# EAGLE board snarc+ (EAGLE 6.2)
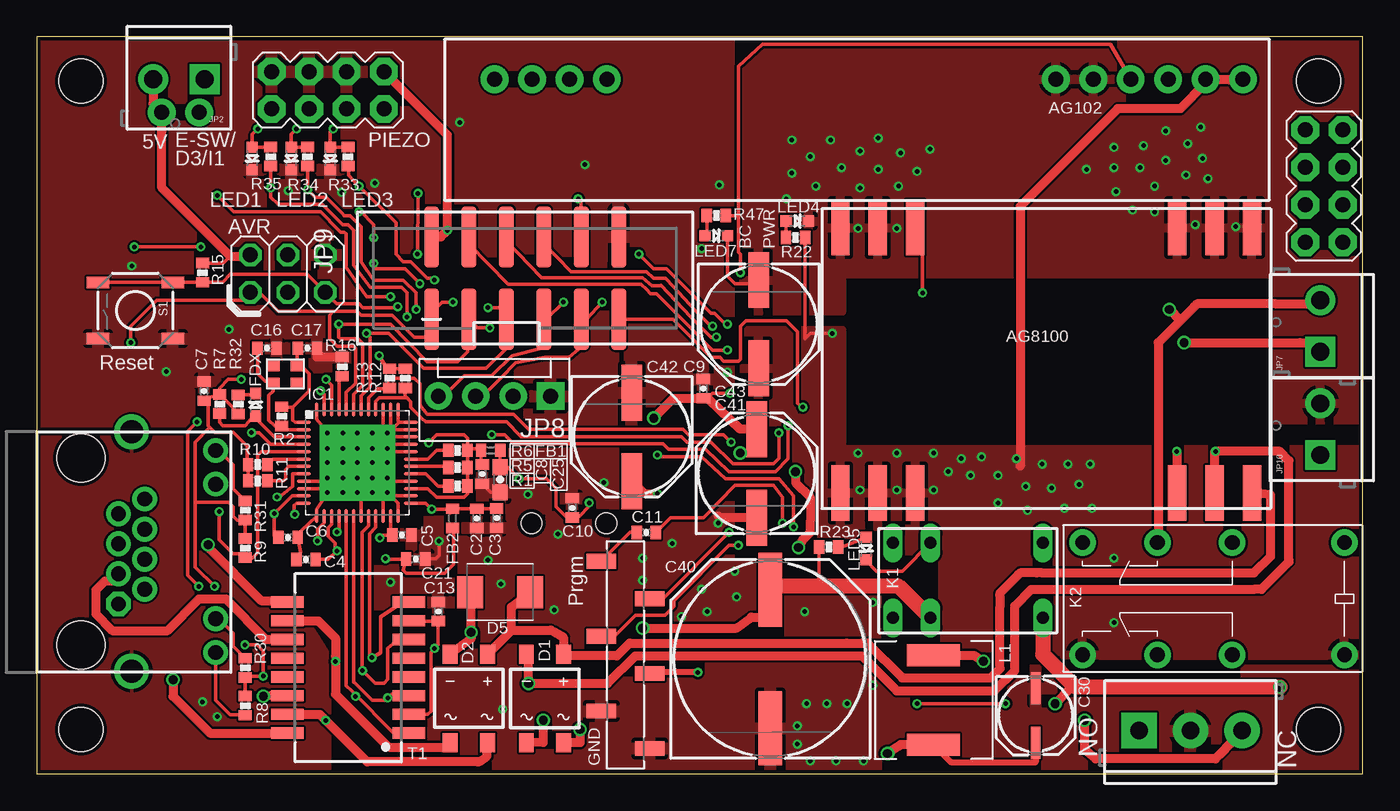
[diagram p1: board, top side]
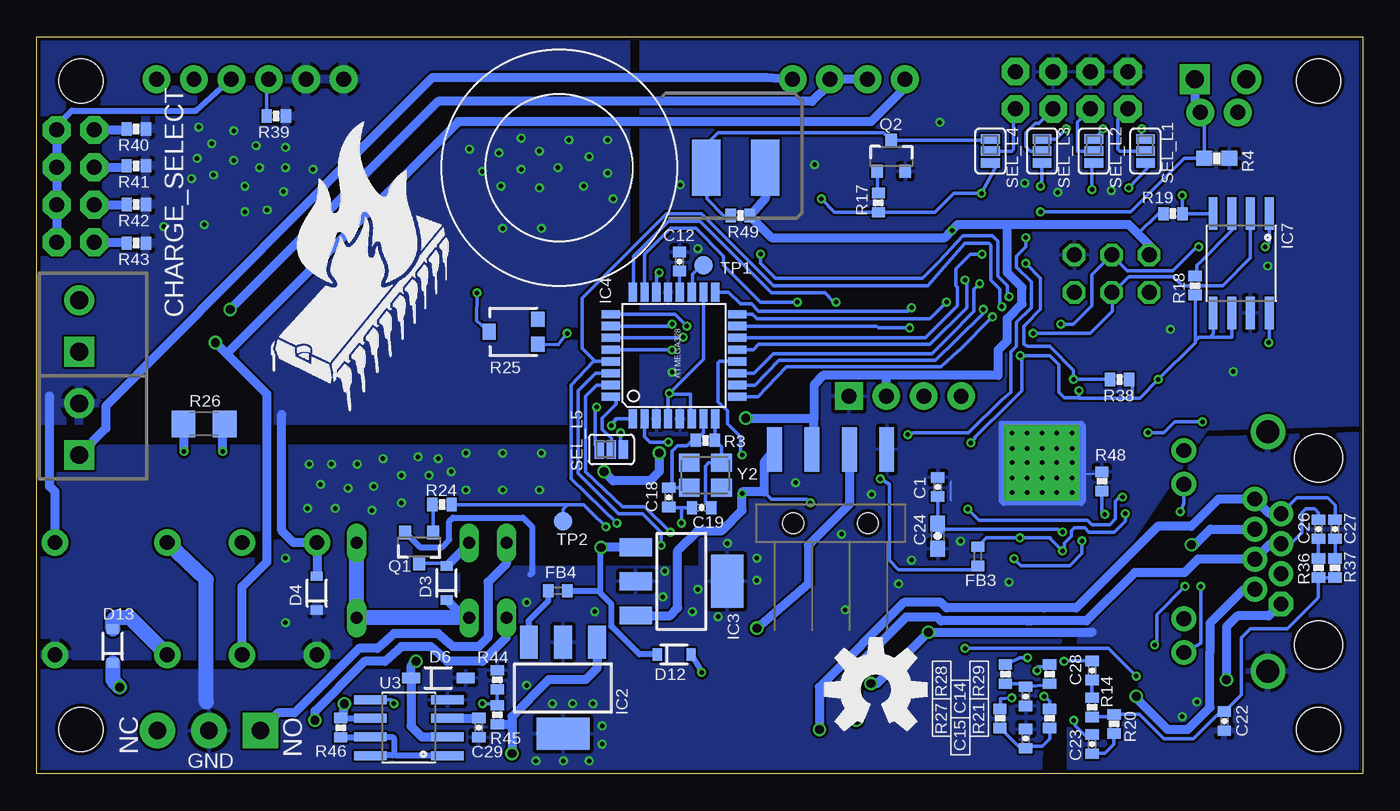
[diagram p2: board, bottom side, seen from below]

Size 90 x 50 mm. Coordinates in mm from the lower left corner, seen from the top.
Outline: 0,0 90,0 90,50 0,50 0,0
Copper layers (1*2*15*16): Top 0.035mm / dielectric 1.5mm / Route2 0.035mm / dielectric 0.15mm / Route15 0.035mm / dielectric 0.2mm / Bottom 0.035mm
Design rules: minimum track width 6mil, minimum drill 12mil, track to track 6mil, track to pad 6mil, pad to pad 6mil, via to via 6mil, smd to smd 0mil, copper to edge 10mil, drill to drill 10mil, minimum pad ring 10mil, minimum via ring 6mil, stop-mask expansion 2mil, vias tented up to drill 100mil, thermal gap 10mil
Net classes: 2 gnd: width 0.305 mm, drill 0.406 mm, clearance 0.203 mm; 3 power usb: width 0.508 mm, drill 0.406 mm, clearance 0.203 mm
Holes 3 mm at 3,47 3,3 87,47 87,3

## Footprints (pad centres in the part's own frame; a part is rotated, then mirrored left to right if it is on the bottom)
AG102 = drill 1.016 pad 1.88: 1 0,0; 2 2.54,0; 3 5.08,0; 4 7.62,0; 5 10.16,0; 6 12.7,0; 7 43.18,0; 8 45.72,0; 9 48.26,0; 10 50.8,0
AG8100 = smd 1.25 x 3.75: 1 -5.08,-18; 2 -2.54,-18; 3 0,-18; 4 17.78,-18; 5 20.32,-18; 6 22.86,-18; 7 22.86,0; 8 20.32,0; 9 17.78,0; 10 0,0; 11 -2.54,0; 12 -5.08,0
0402-CAP = smd 0.7 x 0.9: 1 -0.65,0; 2 0.65,0
0603-CAP = smd 1.1 x 1: 1 -0.85,0; 2 0.85,0
PANASONIC_C = smd 2.2 x 0.65: + 1.9,-0.2; - -1.8,-0.2
PANASONIC_H13 = smd 5 x 1.6: + 4.7,0; - -4.7,0
PANASONIC_E = smd 3.8 x 1.4: + 3,0; - -3,0
2X4 = drill 1.016 pad 1.88 octagon: 1 -3.81,-1.27; 2 -3.81,1.27; 3 -1.27,-1.27; 4 -1.27,1.27; 5 1.27,-1.27; 6 1.27,1.27; 7 3.81,-1.27; 8 3.81,1.27
MBS = smd 1 x 1.3: + -1.27,-3; - 1.27,-3; AC1 -1.27,3; AC2 1.27,3
SOD-323 = smd 0.63 x 0.83: 1 -1.15,0; 2 1.15,0
SMBJ = smd 1.78 x 2.16: A 2.04,0; C -2.03,0
SOD-123 = smd 1.2 x 0.7: 1 -1.85,0; 2 1.85,0
0402 = smd 0.7 x 0.9: 1 -0.65,0; 2 0.65,0
QFN48 = smd 0.95 x 0.23: 1 -3.625,2.75; 2 -3.625,2.25; 3 -3.625,1.75; 4 -3.625,1.25; 5 -3.625,0.75; 6 -3.625,0.25; 7 -3.625,-0.25; 8 -3.625,-0.75; 9 -3.625,-1.25; 10 -3.625,-1.75; 11 -3.625,-2.25; 12 -3.625,-2.75; 25 3.625,-2.75; 26 3.625,-2.25; 27 3.625,-1.75; 28 3.625,-1.25; 29 3.625,-0.75; 30 3.625,-0.25; 31 3.625,0.25; 32 3.625,0.75; 33 3.625,1.25; 34 3.625,1.75; 35 3.625,2.25; 36 3.625,2.75 | smd 0.23 x 0.95: 13 -2.75,-3.625; 14 -2.25,-3.625; 15 -1.75,-3.625; 16 -1.25,-3.625; 17 -0.75,-3.625; 18 -0.25,-3.625; 19 0.25,-3.625; 20 0.75,-3.625; 21 1.25,-3.625; 22 1.75,-3.625; 23 2.25,-3.625; 24 2.75,-3.625; 37 2.75,3.625; 38 2.25,3.625; 39 1.75,3.625; 40 1.25,3.625; 41 0.75,3.625; 42 0.25,3.625; 43 -0.25,3.625; 44 -0.75,3.625; 45 -1.25,3.625; 46 -1.75,3.625; 47 -2.25,3.625; 48 -2.75,3.625 | drill 0.305 pad 1.1 square: EXP@1 -2.025,2.025; EXP@2 -1,2.025; EXP@3 0,2.025; EXP@4 1.025,2.025; EXP@5 -2.025,0.975; EXP@6 -1,0.975; EXP@7 0,0.975; EXP@8 1.025,0.975; EXP@9 -2.025,0.025; EXP@10 -1,0.025; EXP@11 0,0.025; EXP@12 1.025,0.025; EXP@13 -2.025,-1.025; EXP@14 -1,-1.025; EXP@15 0,-1.025; EXP@16 1.025,-1.025; EXP@17 -2.025,-2.025; EXP@18 -1,-2.025; EXP@19 0,-2.025; EXP@20 1.025,-2.025; EXP@21 2.025,-2.025; EXP@22 2.025,-1.025; EXP@23 2.025,0.025; EXP@24 2.025,0.975; EXP@25 2.025,2.025
SOT223 = smd 1.219 x 2.235: 1 -2.311,-3.099; 2 0,-3.099; 3 2.311,-3.099 | smd 3.6 x 2.2: 4 0,3.099
TQFP32-08 = smd 1.27 x 0.559: 1 -4.293,2.8; 2 -4.293,2; 3 -4.293,1.2; 4 -4.293,0.4; 5 -4.293,-0.4; 6 -4.293,-1.2; 7 -4.293,-2; 8 -4.293,-2.8; 17 4.293,-2.8; 18 4.293,-2; 19 4.293,-1.2; 20 4.293,-0.4; 21 4.293,0.4; 22 4.293,1.2; 23 4.293,2; 24 4.293,2.8 | smd 0.559 x 1.27: 9 -2.8,-4.293; 10 -2,-4.293; 11 -1.2,-4.293; 12 -0.4,-4.293; 13 0.4,-4.293; 14 1.2,-4.293; 15 2,-4.293; 16 2.8,-4.293; 25 2.8,4.293; 26 2,4.293; 27 1.2,4.293; 28 0.4,4.293; 29 -0.4,4.293; 30 -1.2,4.293; 31 -2,4.293; 32 -2.8,4.293
SO08-EIAJ = smd 0.61 x 2.21: 1 -1.905,-3.378; 2 -0.635,-3.378; 3 0.635,-3.378; 4 1.905,-3.378; 5 1.905,3.353; 6 0.635,3.353; 7 -0.635,3.353; 8 -1.905,3.353
2X03 = drill 1.016 octagon: 1 -2.54,-1.27; 2 -2.54,1.27; 3 0,-1.27; 4 0,1.27; 5 2.54,-1.27; 6 2.54,1.27
SCREWTERMINAL-3.5MM-2 = drill 1.2 pad 2.032 square: 1 0,0 | drill 1.2 pad 2.032: 2 3.5,0
1X06_SMD_STRAIGHT = smd 1 x 2: 1 0,1.65; 2 -2.54,-1.65; 3 -5.08,1.65; 4 -7.62,-1.65; 5 -10.16,1.65; 6 -12.7,-1.65
SCREWTERMINAL-3.5MM-3 = drill 1.2 pad 2.413 square: 1 0,0 | drill 1.2 pad 2.413: 2 3.5,0; 3 7,0
1X04-SMD = smd 1 x 3: 1 -3.81,5; 2 -1.27,5; 3 1.27,5; 4 3.81,5 | hole 1.4: -2.54,0; 2.54,0
1X02_NO_SILK = drill 1.016 pad 1.88: 1 0,0; 2 2.54,0
MOLEX-1X4 = drill 1.016 pad 1.88 square: 1 0,0 | drill 1.016 pad 1.88: 2 2.54,0; 3 5.08,0; 4 7.62,0
2X6-SHROUDED_SMD = smd 4.15 x 1: 1 -2.794,5.08; 2 2.794,5.08; 3 -2.794,2.54; 4 2.794,2.54; 5 -2.794,0; 6 2.794,0; 7 -2.794,-2.54; 8 2.794,-2.54; 9 -2.794,-5.08; 10 2.794,-5.08; 11 -2.794,-7.62; 12 2.794,-7.62
G5V1 = drill 0.813 long: 1 -5.08,-2.54; 2 -2.54,-2.54; 5 5.08,-2.54; 6 5.08,2.54; 9 -2.54,2.54; 10 -5.08,2.54
G5V-2 = drill 1 pad 1.8: 1 -8.89,-3.81; 4 -1.27,-3.81; 6 3.81,-3.81; 8 8.89,-3.81; 9 8.89,3.81; 11 3.81,3.81; 13 -1.27,3.81; 16 -8.89,3.81
SRN = smd 1.5 x 3.6: P$1 -3.025,0; P$2 3.025,0
LED-0603 = smd 0.762 x 0.762: A -0.762,0; C 0.762,0
SOT23-3 = smd 0.8 x 0.9: 1 -0.95,-1; 2 0.95,-1; 3 0,1.1
0402-RES = smd 0.7 x 0.9: 1 -0.65,0; 2 0.65,0
0603-RES = smd 1.1 x 1: 1 -0.85,0; 2 0.85,0
TRIMPOT-3MM = smd 1 x 0.9: 1 -0.85,-1.65; 3 0.85,-1.65 | smd 1.1 x 0.9: 2 0,1.65
1206 = smd 1.6 x 1.8: 1 -1.4,0; 2 1.4,0
TACTILE_SWITCH_SMD = smd 1.524 x 0.762: 1 -2.54,1.905; 2 2.54,1.905; 3 -2.54,-1.905; 4 2.54,-1.905
SJ_3_PASTE2&3 = smd 0.635 x 1.27: 1 -0.813,0; 2 0,0; 3 0.813,0
PB158-BUZZER = smd 3.81 x 1.93: P$1 0,10; P$2 0,14
HXXXX = smd 0.76 x 2.2: 1 -4.445,-4.128; 2 -3.175,-4.128; 3 -1.905,-4.128; 4 -0.635,-4.128; 5 0.635,-4.128; 6 1.905,-4.128; 7 3.175,-4.128; 8 4.445,-4.128; 9 4.445,4.128; 10 3.175,4.128; 11 1.905,4.128; 12 0.635,4.128; 13 -0.635,4.128; 14 -1.905,4.128; 15 -3.175,4.128; 16 -4.445,4.128
PAD.03X.05 = smd 1.27 x 1.27: P$1 0,0
RJHSE-5484 = drill 1 pad 1.676 octagon: 1 3.555,2.54 | drill 1 pad 1.676: 2 2.565,4.32; 3 1.515,2.54; 4 0.525,4.32; 5 -0.525,2.54; 6 -1.515,4.32; 7 -2.565,2.54; 8 -3.555,4.32; 9 -6.86,9.14; 10 -4.57,9.14; 11 4.57,9.14; 12 6.86,9.14 | drill 1.57 pad 2.184: GND@1 -8.13,3.43; GND@2 8.13,3.43 | hole 3.25: -6.35,0; 6.35,0
SO08 = smd 0.61 x 2.21: 1 -1.905,-2.616; 2 -0.635,-2.616; 3 0.635,-2.616; 4 1.905,-2.616; 5 1.905,2.616; 6 0.635,2.616; 7 -0.635,2.616; 8 -1.905,2.616
CRYSTAL-SMD-2.5X2-ABM10 = smd 0.9 x 0.8: P$1 -0.85,-0.65; P$2 0.8,-0.65; P$3 0.8,0.6; P$4 -0.85,0.6
XTAL-CSX750 = smd 1.4 x 1.2: 1 -1.1,-0.85; 2 1.1,-0.85; 3 1.1,0.85; 4 -1.1,0.85

## Placement (x,y rotation side)
AG102  AG102  [AG102]  81.88,47.12 180 top
AG8100  AG8100  [AG8100]  59.63,37.05 0 top
C1  0.1uF  [0402-CAP]  28.84,19.46 90 bottom
C2  0.1uF  [0402-CAP]  29.86,17.32 270 top
C3  0.1uF  [0402-CAP]  31.21,17.34 270 top
C4  0.1uF  [0402-CAP]  18.27,14.54 180 top
C5  0.1uF  [0402-CAP]  24.79,16.2 0 top
C6  0.1uF  [0402-CAP]  17.05,16.04 0 top
C7  0.1uF  [0402-CAP]  11.36,25.96 90 top
C8  0.1uF  [0402-CAP]  30.23,20.32 270 top
C9  0.1uF  [0402-CAP]  45.23,26.12 90 top
C10  0.1uF  [0402-CAP]  36.34,18.04 90 top
C11  0.1uF  [0402-CAP]  41.38,16.38 180 top
C12  0.1uF  [0402-CAP]  46.38,34.75 90 bottom
C13  0.1uF  [0402-CAP]  27.25,11 270 top
C14  0.1uF  [0402-CAP]  22.88,5.25 90 bottom
C15  0.1uF  [0402-CAP]  22.88,2.38 270 bottom
C16  10pF  [0402-CAP]  15.62,28.88 0 top
C17  10pF  [0402-CAP]  18.38,28.88 0 top
C18  18pF  [0402-CAP]  47.1,18.75 270 bottom
C19  18pF  [0402-CAP]  44.88,18.05 180 bottom
C21  3.3uF  [0402-CAP]  25.72,14.56 0 top
C22  1000pF (2kV)  [0402-CAP]  9.38,3.57 90 bottom
C23  22nF  [0402-CAP]  18.38,2 90 bottom
C24  10uF  [0603-CAP]  28.84,16.11 270 bottom
C25  10uF  [0603-CAP]  31.45,19.95 270 top
C26  22nF  [0402-CAP]  3,16.59 90 bottom
C27  22nF  [0402-CAP]  1.88,16.59 90 bottom
C28  22nF  [0402-CAP]  18.38,7 90 bottom
C29  470pF  [0402-CAP]  60,3.12 270 bottom
C30  100uF 6.3V (miniture version)  [PANASONIC_C]  68,4 270 top
C40  1000uF  [PANASONIC_H13]  49.8,7.79 90 top
C41  470uF  [PANASONIC_E]  48.87,20.38 90 top
C42  470uF  [PANASONIC_E]  40.38,22.86 270 top
C43  470uF  [PANASONIC_E]  49,30.5 270 top
CHARGE_SELECT  M04X2  [2X4]  87.38,39.88 90 top
D1  HD01-T  [MBS]  34.49,5.1 180 top
D2  HD01-T  [MBS]  29.32,5.11 180 top
D3  [SOD-323]  62.19,12.94 90 bottom
D4  [SOD-323]  71,12.25 90 bottom
D5  SMAJ58CA  [SMBJ]  31.45,12.31 180 top
D6  1N5819HW  [SOD-123]  62.75,6.5 0 bottom
D12  [SOD-323]  46.74,8.1 0 bottom
D13  [SOD-323]  84.84,8.66 90 bottom
FB1  BML15HB121SN1  [0402]  30.8,21.94 180 top
FB2  BML15HB121SN1  [0402]  28.21,17.32 90 top
FB3  BML15HB121SN1  [0402]  26.12,14.75 90 bottom
FB4  BML15HB121SN1  [0402]  54.63,12.41 0 bottom
IC1  WIZ_W5200  [QFN48]  21.76,21.1 0 top
IC2  UA78M05  [SOT223]  54.29,5.81 180 bottom
IC3  UA78M33  [SOT223]  46.24,13.04 270 bottom
IC4  ATMEGA328  [TQFP32-08]  46.75,28.38 90 bottom
IC7  AT45DB161D  [SO08-EIAJ]  8.25,34.62 180 bottom
JP1  AVR  [2X03]  17.03,33.93 0 top
JP2  [SCREWTERMINAL-3.5MM-2]  11.39,47.12 180 top
JP3  Prgm  [1X06_SMD_STRAIGHT]  39.95,14.41 90 top
JP4  STRIKE  [SCREWTERMINAL-3.5MM-3]  74.81,2.93 0 top
JP5  [1X04-SMD]  36.12,17 0 bottom
JP6  [1X02_NO_SILK]  11.02,44.88 180 top
JP7  12V (SLA Battery)  [SCREWTERMINAL-3.5MM-2]  87.12,28.62 90 top
JP8  [MOLEX-1X4]  34.88,25.62 180 top
JP9  M05x2_SMD  [2X6-SHROUDED_SMD]  31.88,33.62 90 top
JP10  Thermistor  [SCREWTERMINAL-3.5MM-2]  87.12,21.62 90 top
K1  G5V1  [G5V1]  63.2,13.12 0 top
K2  G5V-2  [G5V-2]  79.88,11.88 180 top
L1  220uF  [SRN]  60.88,5 270 top
LED1  [LED-0603]  14.62,41.75 270 top
LED2  [LED-0603]  17.27,41.75 270 top
LED3  [LED-0603]  19.92,41.75 270 top
LED4  GREEN-ON  [LED-0603]  51.62,37.5 0 top
LED5  RED-STRIKE  [LED-0603]  56.3,15.28 270 top
LED6  RED  [LED-0603]  14.85,25.04 90 top
LED7  [LED-0603]  46.12,36.5 0 top
Q1  BCX19  [SOT23-3]  64.06,15.37 180 bottom
Q2  BCX19  [SOT23-3]  32,41.88 0 bottom
R1  10K  [0402-RES]  28.57,19.52 180 top
R2  1M  [0402-RES]  16.62,24.25 90 top
R3  1M  [0402-RES]  44.62,22.62 180 bottom
R4  1M  [0603-RES]  9.9,41.76 180 bottom
R5  10K  [0402-RES]  28.57,20.77 180 top
R6  10K  [0402-RES]  28.57,21.95 180 top
R7  10K  [0402-RES]  12.41,25.09 270 top
R8  10K  [0402-RES]  14.14,4.62 270 top
R9  10K  [0402-RES]  14.14,15.31 270 top
R10  10K  [0402-RES]  15,20.97 0 top
R11  10K  [0402-RES]  15,19.88 0 top
R12  10K  [0402-RES]  25.01,26.82 270 top
R13  10K  [0402-RES]  23.95,26.82 270 top
R14  75R  [0402-RES]  18.38,4.5 90 bottom
R15  10K  [0402-RES]  11.25,34 270 top
R16  10K  [0402-RES]  20.73,27.62 90 top
R17  4K7  [0402-RES]  32.88,38.75 90 bottom
R18  10K  [0402-RES]  11.38,33.12 270 bottom
R19  10K  [0402-RES]  12.88,38 0 bottom
R20  75R  [0402-RES]  16.88,3.38 270 bottom
R21  49R9  [0402-RES]  21.25,3.75 90 bottom
R22  470R  [0402-RES]  51.5,36.38 0 top
R23  470R  [0402-RES]  53.76,15.38 180 top
R24  4K7  [0402-RES]  62.5,18.26 180 bottom
R25  (optional) 100k  [TRIMPOT-3MM]  57.65,29.99 90 bottom
R26  249R (optional)  [1206]  78.65,23.74 0 bottom
R27  49R9  [0402-RES]  24.62,3.75 90 bottom
R28  49R9  [0402-RES]  24.25,6.75 90 bottom
R29  49R9  [0402-RES]  21.25,6.75 90 bottom
R30  200R  [0402-RES]  14.14,7.18 270 top
R31  200R  [0402-RES]  14.14,17.86 270 top
R32  200R  [0402-RES]  13.67,25.05 90 top
R33  100R  [0402-RES]  21.12,41.88 90 top
R34  100R  [0402-RES]  18.38,41.88 90 top
R35  100R  [0402-RES]  15.88,41.88 90 top
R36  75R  [0402-RES]  3,13.96 90 bottom
R37  75R  [0402-RES]  1.88,13.96 90 bottom
R38  10K  [0402-RES]  16.5,26.75 180 bottom
R39  47K  [0402-RES]  73.75,44.62 180 bottom
R40  47K  [0402-RES]  83.25,43.75 180 bottom
R41  47K  [0402-RES]  83.25,41.25 180 bottom
R42  47K  [0402-RES]  83.25,38.62 180 bottom
R43  47K  [0402-RES]  83.25,36 180 bottom
R44  1K2  [0402-RES]  58.75,6.38 270 bottom
R45  4K7  [0402-RES]  58.75,4 90 bottom
R46  0.33R  [0402-RES]  69.38,3.12 270 bottom
R47  100R  [0402-RES]  46.12,37.88 180 top
R48  28K7  [0402-RES]  17.7,19.83 90 bottom
R49  1K  [0402-RES]  42.25,37.88 0 bottom
S1  [TACTILE_SWITCH_SMD]  6.69,31.43 180 top
SEL_L1  JUMPER-32-3  [SJ_3_PASTE2&3]  14.74,42.25 90 bottom
SEL_L2  JUMPER-32-3  [SJ_3_PASTE2&3]  18.25,42.25 90 bottom
SEL_L3  JUMPER-32-3  [SJ_3_PASTE2&3]  21.76,42.25 90 bottom
SEL_L4  JUMPER-32-3  [SJ_3_PASTE2&3]  25.27,42.25 90 bottom
SEL_L5  JUMPER-32-3  [SJ_3_PASTE2&3]  51,22 180 bottom
SG1  PIEZO  [PB158-BUZZER]  54.55,41.12 270 bottom
T1  HX2019NL  [HXXXX]  21.14,7.2 90 top
TP1  TEST-POINT3X5  [PAD.03X.05]  44.75,34.5 0 bottom
TP2  TEST-POINT3X5  [PAD.03X.05]  54.29,17.14 0 bottom
U1  M04X2  [2X4]  19.75,46.38 180 top
U2  RJ45_LED  [RJHSE-5484]  3,15.08 270 top
U3  BuckConverter  [SO08]  64.75,3.12 90 bottom
U$15  OSHW-LOGOL  [OSHW-LOGO-L]  33.05,5.71 0 bottom
U$16  HSBNE_LOGOMED  [HSBNE_MED]  74.07,24.44 0 bottom
Y1  25Mhz  [CRYSTAL-SMD-2.5X2-ABM10]  16.88,27.12 0 top
Y2  16MHz  [XTAL-CSX750]  44.62,20.25 0 bottom

## Tracks (layer width: path | path; a pad name or v marks a point on that pad's centre or on a via)
3.3V  (via drill 0.3)
  Top 0.254: FB1.1 31.45,21.38 C25.1 | C25.1 | C25.1 31.94,20.81 v32.75,20 34.61,20 35.24,19.37 35.24,18.1 35.95,17.39 C10.1 36.41,17.46 36.83,17.46 37.5,18.13 v37.5,18.38
  Top 0.61: C42.+ 41.12,19.12 41.25,19 v42.12,19
  Bottom 0.254: FB3.1 26.23,13.85 31.5,13.85 32.12,14.48 32.12,18.12 32.12,19.62 v32.75,20 | v37.5,18.38 37.75,18.62 40.12,18.62 40.62,19.12
  Bottom 0.61: IC3.3 47.02,10.73 46.5,11.25 46.5,15.12 45.12,16.5 43.5,16.5 42.12,17.88 v42.12,19 42.12,19.12 40.62,19.12 40.62,21.12 JP5.1
3V3A  (via drill 0.3)
  Top 0.254: 16.48,15.76 C6.1 16.12,16.16 v16.12,17.65 17.32,18.85 IC1.11 | IC1.15 20.01,16.93 19.77,16.7 19.77,16.1 20.25,15.62 20.25,15.25 v20.38,15.12 19.79,14.54 C4.1 | IC1.23 24.01,16.32 C5.1 23.47,16.2 v23.27,16
  Bottom 0.254: v16.12,17.65 16.12,17.12 16.85,16.4 18.57,16.4 18.88,16.7 19.57,16.7 19.77,16.5 19.77,16.1 20.25,15.62 20.25,15.25 v20.38,15.12 21.2,15.95 21.2,16 v23.27,16 25.52,16 FB3.2
3V3D  (via drill 0.3)
  Top 0.254: R6.1 R5.1 R1.1 29.25,19.5 29.25,19 29,18.75 27.12,18.75 26.52,19.35 IC1.27 | R8.1 R30.2 14.23,6.62 v15.38,6.62 15.38,8.31 14.94,8.74 v14.12,8.74 | 10.75,17.56 10.75,17.78 | 10.75,17.78 10.75,18.41 | 10.75,18.41 10.75,18.84 | IC1.47 19.51,25.74 v19.25,26 | R6.1 29.34,22.05 30.04,22.05 FB1.2 30.16,21.05 C8.1 | R7.1 12.41,26.16 13,26.75 v13.88,26.75 | R32.1 13.67,24.48 R7.1 | 12.4,25.75 R7.1 | R12.1 R13.1 23.74,27.52 v23.24,28.38 | R7.1 11.46,25.43 C7.1 11.62,25.54 11.62,23.62 11.75,23.5 | 29.25,21.97 R6.1 | C13.2 27.38,10.35 C13.2 | C13.2 25.91,10.35 T1.7 | 10.75,17.56 10.75,17.78 | 10.75,17.78 10.75,18.41 | 10.75,18.41 10.75,18.84 | R11.1 R10.1 14.29,21.03 14.29,22.23 13.34,23.18 12.06,23.18 11.75,23.5 | R9.1 R31.2 13.59,17.21 13.34,17.46 13.34,18.1 13.02,18.41 10.75,18.41 | 10.75,17.56 10.75,16.88 10.75,14.02 v12.06,12.71 | T1.2 26.52,4.03 26.75,4.25 26.75,8.25 v27,8.5 27.25,8.75 C13.2 | v26.59,22.44 26.72,22.59 27.12,23 29,23 29.25,22.75 29.25,21.97 | 29.25,21.97 R6.1 | 11.75,23.5 10.75,22.5 10.75,21.15 10.75,20.64 10.75,19.37 10.75,19.2 10.75,18.84
  Bottom 0.254: 15.62,25.49 15.13,25.49 v13.88,26.75 11.38,29.25 11.38,29.38 | 15.62,25.49 19.25,25.49 | v19.25,26 19.25,25.49 | 19.25,25.49 19.26,25.5 20.25,25.5 20.62,25.88 20.62,27.75 21.25,28.38 v23.24,28.38 23.12,28.36 23.12,26 23.88,25.25 26.31,22.82 26.31,22.73 v26.59,22.44 | v27,8.5 17.25,8.5 v15.38,6.62 | R38.1 15.62,26.52 15.62,25.49 | R18.2 11.38,29.38 | IC7.6 8.88,29.64 8.88,29.62 10.38,29.62 | 10.38,29.62 11.12,29.62 11.38,29.38 | IC7.5 10.15,29.84 10.38,29.62 | v12.06,12.71 13.97,10.79 13.97,8.89 v14.12,8.74
5V  (via drill 0.3, 0.6)
  Top 0.254: R15.1 12.65,34.65 13.12,35.12 | 45.52,25.48 45.86,25.81 v47.06,25.81
  Top 0.61: v41.88,24.12 43.23,25.48 C9.1 45.52,25.48 45.62,25.38 47.74,23.38 C41.+ 48.99,21.75 49,21.75 48.12,21.75 v47.75,21.77 | v51.5,20.5 51.5,19.75 52.5,18.75 52.5,17.12 52.5,16.38 52,15.88 v51.7,15.35 | JP1.2 14.42,35.12 13.12,35.12 8.48,39.77 8.48,43.6 JP6.2 7.89,45.46 JP2.2 | JP9.2 27.42,36.42 v27.88,36.88 27.88,43.33 U1.1
  Bottom 0.254: IC4.18 44.75,28.12 46.75,26.12 | 46.75,26.12 v47.06,25.81 | v47.06,25.81 46.75,26.12 | 46.75,26.12 47.12,25.75 | IC4.6 45.62,24.16 45.62,25.75 47.12,25.75 | IC4.4 47.15,25.73 47.12,25.75 | 47.12,25.75 v47.06,25.81 | v47.06,25.81 46.75,26.12 | 46.75,26.12 47.12,25.75 | v47.06,25.81 46.75,26.12 | R19.1 13.88,38 15.25,36.62
  Bottom 0.406: 51.5,15.25 51.5,15.36 51.62,15.23 51.75,15.11 51.75,12.5 | 51.75,12.5 51.75,12.25 51.56,12.06 51,11.5 51,10 49.09,8.1 D12.1 | FB4.2 51.84,12.41 51.75,12.5
  Bottom 0.61: IC3.1 51.5,15.36 51.61,15.36 v51.7,15.35 | JP1.2 14.49,35.87 15.25,36.62 15.88,37.25 24,37.25 | 24,37.25 24.12,37.25 27.5,37.25 v27.88,36.88 28.38,36.38 40.12,36.38 41.62,37.88 R49.2 40.55,39.05 SG1.P$2 | v41.88,24.12 37.24,24.12 | v47.75,21.77 47.75,20.5 48.38,19.88 50.88,19.88 v51.5,20.5 | JP5.2 37.24,21.12 37.24,24.12 | 32.38,27.02 24.75,27.02 24.75,28.75 24.12,29.38 24.12,30.88 23.12,31.88 23.12,33 24.12,34 24.12,37.12 24,37.25 | 32.38,27.02 36.62,27.02 37.24,26.39 37.24,24.12 | JP8.2 32.34,26.98 32.38,27.02
6V  (via drill 0.6)
  Top 0.406: C30.+ 67.8,0.8 67.75,0.75 62.1,0.75 L1.P$2
  Top 0.61: L1.P$2 58.65,1.98 v57.75,1.38
  Bottom 0.61: IC2.1 51.98,7.14 52.75,6.38 55.25,6.38 57.75,3.88 57.75,3.5 | 57.75,3.5 v57.75,1.38 | R45.1 57.9,3.35 57.75,3.5
12V  (via drill 0.6)
  Top 0.254: R23.2 53.1,12.77 53.12,12.75
  Top 0.406: 70.38,6 70.38,5.75
  Top 0.61: 70.38,5.75 70.12,5.75 v69.12,4.75 | v41.12,9.88 47.5,9.88 48.5,10.62 49.62,10.62 49.75,10.75 49.75,12.44 C40.+
  Top 1.016: C40.+ 50.17,12.75 53.12,12.75 54.25,12.75 58.48,12.75 K1.2 | K1.5 68.28,8.1 68.62,7.75 70.38,6 70.5,5.88 76.5,5.88 v84.38,5.88
  Bottom 0.406: R46.1 67.38,3.77 U3.6
  Bottom 0.61: K1.2 60.97,10.57 D3.1 | v69.12,4.75 69.25,3.9 R46.1 | JP5.3 34.84,18.28 37.62,15.5 37.62,12.88 v41.12,9.88
  Bottom 1.016: 60.69,10.54 K1.2 K1.5 K1.6 | D13.1 84.84,6.34 v84.38,5.88
A0  (via drill 0.3)
  Top 0.254: v38.38,32 37.33,30.83 JP9.9 37,30.79 37,29 36.12,28.25 34.5,28.25 32.5,27.88 31.5,26.88 30.25,25.62 JP8.3
  Bottom 0.254: v38.38,32 40.88,32 42.5,33.62 43.38,34.5 43.38,35.12 45.25,37 47,37 48.75,35.25 IC4.23
A1  (via drill 0.3)
  Top 0.254: v35.75,32 34.58,30.83 JP9.7 34.38,30.79 34.38,29 34.25,28.88 32.25,28.38 30.88,27 29,27 27.62,25.62 JP8.4
  Bottom 0.254: IC4.24 49.5,32.72 49.5,35.12 47.12,37.5 45,37.5 41.62,34.12 40.12,32.62 36.5,32.62 35.88,32 v35.75,32
A2  (via drill 0.3)
  Top 0.254: v45.88,30.38 45.75,30.38 44.75,31.38 42.75,33.55 42.67,33.62 41.88,33.62 41.38,34.06 36.25,34.06 34.41,35.96 JP9.8
  Bottom 0.254: IC4.25 46.67,31.18 v45.88,30.38
A6
  Bottom 0.254: 45.5,32.72 IC4.19 45.5,32.72 | TP1.P$1 44.88,34.5 45.5,33.88 45.5,32.72
AREF1
  Bottom 0.254: C12.1 46.38,32.69 IC4.20
BATT_STAT  (via drill 0.3)
  Top 0.254: v47.75,34 47.75,35.25 47.62,35.38 47.62,37.75 | 47.62,37.75 47.62,48 49.25,49.5 72.88,49.5 AG102.4 | R47.1 47.5,37.88 47.62,37.75
  Bottom 0.254: IC4.22 47.95,33.8 v47.75,34 | R39.2 74.4,46.98 AG102.4
BATT_THERM
  Bottom 0.61: AG102.7 40.45,47.25 63.12,47.25 68.25,42.12 85.32,24.93 85.32,23.43 JP10.1
D10  (via drill 0.3)
  Top 0.254: v25.84,35.25 v25.88,39.38 | JP9.10 36.95,38.8 v36.75,39
  Bottom 0.254: IC4.14 29.68,29.57 27.5,31.75 27.5,33 27.62,33.12 27.62,34.25 26.62,35.25 v25.84,35.25 | SEL_L4.1 24.77,41.44 v25.88,39.38 27.75,39.38 29.02,38.1 R17.1 35.85,38.1 v36.75,39
E-STOP  (via drill 0.3)
  Top 0.254: v51,23.62 51,21.38 50.12,20.5 47,20.5 45.38,22 43.88,22 42.88,22 42.5,22.38 32.38,22.38 31.75,23 v30.88,23 | v22.88,36.38 22.88,36.5 22.88,37.25 22,38.12 v21.88,38.12
  Bottom 0.254: IC4.1 50.67,24.08 v51,23.62 | v30.88,23 30.5,23.12 30.38,23.12 26.75,23.12 24.5,25.38 23.88,25.88 23.88,26.88 23.88,28.62 23.5,29 23.5,30.62 22.5,31.62 22.5,33.38 23.5,34.38 23.5,35.12 22.88,35.75 v22.88,36.38 | v21.88,38.12 17.38,38.12 15.75,38.12 13.25,40.62 12.12,41.76 R4.2 10.76,44.61 JP6.1
  Bottom 0.61: JP2.1 11.39,45.25 JP6.1
ETH_CS  (via drill 0.3)
  Top 0.254: IC1.41 22.51,25.51 23.12,26.12 23.59,26.12 R13.2 23.7,26.82 23.75,26.84 25.62,26.84 26,26.46 26,25.5 26,25 26.5,24.38 27,24.38 28.62,24.38 32.38,24.38 33.38,23.38 43.88,23.38 44.25,23 46.62,23 v47.12,22.5
  Bottom 0.254: v47.12,22.5 48.38,22.5 48.75,22.88 IC4.2
ETH_INT  (via drill 0.3)
  Top 0.254: IC1.40 23.01,25.26 23.25,25.5 24.62,25.5 25.12,25.5 25.38,25.25 | R12.2 25.01,25.61 25.38,25.25 | 25.38,25.25 25.38,24.88 26.12,24.12 26.38,23.88 26.62,23.88 28.88,23.88 31.88,23.88 32.88,22.88 43.75,22.88 44.12,22.5 45.75,22.5 47.25,21.02 50,21.02 50.38,21.39 v50.38,23.12
  Bottom 0.254: SEL_L5.1 50.38,22.19 v50.38,23.12
ETH_RST  (via drill 0.3)
  Top 0.254: IC1.46 20.01,26.36 v19.62,26.75 | v22.88,34.62 22.88,34.25 25,34.25 v26,33.25
  Bottom 0.254: R38.2 v19.62,26.75 19.62,27.38 21.25,29 22.75,29 23,29.12 23,30.38 22.88,30.5 21.88,31.5 21.88,33.62 v22.88,34.62 | IC4.11 41.33,27.18 40,28.5 29.38,28.5 29.25,28.5 28.12,29.62 26.38,31.38 26.38,32.88 v26,33.25
FDX_LED
  Top 0.254: IC1.3 16.12,22.85 14.82,24.15 14.82,24.25 | R7.2 12.41,23.84 12.62,23.62 14.12,23.62 14.38,23.88 14.5,24.05 14.85,24.05 LED6.A 14.82,24.27 14.82,24.25 | 14.82,24.25 14.82,24.28
FLASH_CS  (via drill 0.3)
  Top 0.254: v46.88,30.5 46.75,30.5 46,31.25 45.75,31.25 43.12,33.88 42.75,34.25 41.88,34.25 v40.88,35.25 | v12.25,39.25 13.38,38.12 19.25,38.12 20.5,36.88 20.62,36.75 20.88,36.75 21,36.62 21,34.38 22.38,32.38 24.12,32.38 v24,32.38
  Bottom 0.254: IC4.26 47.12,30.38 v46.88,30.5 | 11.12,38 11.25,38 R19.2 12.25,38.02 v12.25,39.25 | 11.12,38 IC7.4 | IC7.4 | v40.88,35.25 40.88,34.62 39.88,33.62 29.88,33.62 28.75,34.75 27.12,36.5 25.12,36.5 24.75,36.12 24.75,33.75 24.12,33.12 24.12,32.5 v24,32.38 | 11.12,38 IC7.4
GND  (via drill 0.3)
  Top 0.254: IC1.9 19.51,19.85 IC1.EXP@13 | IC1.10 19.46,19.35 IC1.EXP@17 19.01,17.95 IC1.13 17.9,16.46 C6.2 17.9,15.02 C4.2 | IC1.48 19.01,24.05 IC1.EXP@1 IC1.EXP@2 | IC1.28 24.01,19.85 IC1.EXP@22 | IC1.26 24.01,18.85 IC1.EXP@21 | IC1.22 23.51,18.8 IC1.EXP@21 | IC1.24 24.51,18.35 IC1.EXP@21 | IC1.19 22.01,18.82 IC1.EXP@19 | IC1.EXP@20 IC1.EXP@21 | v27.3,15.78 27.3,14.82 27.07,14.6 26.41,14.6 C21.2 | IC1.39 23.51,23.4 IC1.EXP@25 | IC1.38 24.01,23.35 IC1.EXP@25 | IC1.33 23.79,22.35 IC1.EXP@24 23.79,21.85 IC1.32 | IC1.34 23.79,22.85 IC1.EXP@25 | IC1.35 24.12,23.35 | 24.12,23.35 23.79,23.35 IC1.EXP@25 | IC1.36 24.6,23.85 | 24.6,23.85 24.5,23.75 24.12,23.35 | IC1.37 24.51,23.94 24.6,23.85 | C25.2 30.81,19.1 C8.2 | 19.02,28.27 19,28.25
  Top 0.61: C41.- 46.37,17.38 46.25,17.5 | R16.2 19.02,28.27
  Bottom 0.152: 19.05,21.59 19,21.59 | 19.05,22.86 19,22.86 | 19.05,20.32 19,20.32 17.78,20.32 R48.2 | 27.94,18.55 27.94,19.82
  Bottom 0.254: 19,18.5 19.12,18.38 | 24.38,18.38 24.5,18.5 | 19.12,23.75 19,23.62 | C18.2 47.05,18.05 C19.2 46.2,18.05 46.25,18 v46.25,17
  Bottom 0.406: 19,23.62 19,22.86 19,21.59 19,20.32 19,18.5 | 19.12,18.38 24.38,18.38 | 24.5,18.5 24.5,23.75 19.12,23.75 | Q1.2 65,16.37 64,15.38 62.5,15.38 62,15.88 62,17.12 61.75,17.38 57,17.38 56.38,16.75 56.38,13.62 56.5,13.5
  Bottom 1.016: 78.5,4.88 78.5,13.16 K2.4
  other vias: 6.45,34.45 35.38,16.25 8.79,27.27 30.62,14.49 24,13 31.62,4.38 31.5,12.88 45.12,35.62 20.7,39.45 17.07,39.56 47.5,12 46.88,27.25 38.5,19.75 13.04,30.15 22.94,40.08 35.12,11.12 45.5,11 52.25,4.75 53.62,4.75 55,4.75 51.62,3.25 52.12,11 56.75,11.62 45.12,12.5 47.38,13.75 43.12,15.62 41.12,13.12 41.12,14.62 56.75,6 54.25,0.88 56.12,0.88 52.5,0.88 51.62,2 43.75,10.66 28.7,44.2 37.2,41.33 46.33,39.95 33.33,18.95
  pour Top: 19.86,23 19.86,19.2 23.66,19.2 23.66,23
  pour Bottom: 0,50 49,49.88 49,23 45,23 45,14 60,14 60,7 90,7 90,0 21.88,0 21.56,7.46 16.56,14.68 16.32,14.83 10.57,23.36 0,23.68
  pour Top: 0,50 0,23.91 16.75,23.91 16.75,26.12 26.75,26.12 26.62,16.25 21.25,16.25 21.25,0 90,0 90,7 60.12,7 60.12,14 47,14 47,50
I_SEL  (via drill 0.3)
  Top 0.254: JP9.11 43.17,30.83 45.75,28.25 46.38,28.25 46.62,28 47.62,28 47.75,28.12 47.75,30.38 48.12,30.75 50.75,30.75 50.88,30.75 51.62,30 51.62,25.12 v52,24.88
  Bottom 0.254: SEL_L5.3 52.12,22.31 52.12,24.62 v52,24.88
INT_0
  Bottom 0.254: IC4.32 50.67,25.58 50.67,25.07 51.62,24.12 51.62,23.38 51,22.75 SEL_L5.2
LED1  (via drill 0.3)
  Top 0.254: 20.88,37.25 21.12,37.25 21.5,36.88 21.5,35.38 21.5,34.5 22.62,33 23.88,33 24.75,33 25.12,32.62 v25.12,31 | 20.88,37.25 20.75,37.25 | 20.75,37.25 20.88,37.25 | 20.88,37.25 20.75,37.25 | 20.75,37.25 19.5,38.5 19.38,38.62 19.12,38.62 16.38,38.62 15.88,39.12 v15.88,39.75 | v15.88,39.75 R35.1 v15.88,39.75
  Bottom 0.254: IC4.9 41.42,25.57 41.05,25.57 39.12,27.62 28.62,27.62 27.44,28.69 27.38,28.75 v25.12,31 | v15.88,39.75 14.61,41.07 SEL_L1.1
LED2  (via drill 0.3)
  Top 0.254: R34.1 v18.38,39.62 18.62,39.38 18.88,39.12 19.62,39.12 20.75,38 20.88,37.88 21.25,37.88 22,37.12 22,35.62 22,34.75 22.88,33.5 24.88,33.5 25.75,32.62 v25.75,31.5
  Bottom 0.254: IC4.10 41.25,26.38 39.62,28.05 29,28.05 27.56,29.44 25.75,31.25 v25.75,31.5 | v18.38,39.62 18.38,40.88 18.38,41.44 SEL_L2.1
LED3  (via drill 0.3)
  Top 0.254: R33.1 21.15,40.6 21.5,40.25 v21.88,39.88 24.31,37.44 24.38,37.38 24.38,35.25 24.88,34.75 25.38,34.75 26.5,33.62 26.88,33.62 v27,33.5
  Bottom 0.254: IC4.13 41.35,28.77 41,29.12 30.88,29.12 29.38,29.12 26.88,31.62 26.88,33.38 v27,33.5 | SEL_L3.1 21.76,40.31 v21.88,39.88
LINK_LED  (via drill 0.3)
  Top 0.254: IC1.5 15.22,21.85 15,21.62 15,19.07 15,15 14.61,14.61 14.2,14.61 R9.2 | 13.93,14.62 R9.2 | 13.86,14.62 R9.2 | v12.38,17.78 12.38,15.88 13.34,14.92 13.88,14.92 R9.2
  Bottom 0.254: U2.10 12.14,18.34 v12.38,17.78
MISO  (via drill 0.3)
  Top 0.254: IC1.44 21.01,25.89 21.62,26.5 21.62,27.75 21.62,28.88 21.5,29 20.38,29 19.88,29.5 19.88,31.12 20.12,31.38 | 20.12,31.38 16.38,31.38 15.09,32.66 JP1.1 13.96,32.12 8.12,32.12 6.38,30.38 v6.38,29.25 | 20.12,31.38 21.75,31.38 22,31.12 24.12,31.12 25.62,29.62 26.5,29.62 26.75,29.88 26.75,30.79 JP9.1 | 26.5,31.12 JP9.1 | v28.25,32 27.5,32 26.88,31.38 26.88,30.91 JP9.1
  Bottom 0.254: IC4.16 41.42,31.18 41.12,30.88 33.5,30.88 29.38,30.88 29.25,31 v28.25,32 | IC7.8 6.34,29.66 v6.38,29.25
MOSI  (via drill 0.3)
  Top 0.254: IC1.43 21.51,25.76 22.12,26.38 22.12,29.2 21.82,29.5 20.62,29.5 20.5,29.62 v20.5,30.5 24,30.5 26.5,27.95 28.57,27.95 29.25,28.62 29.25,30.75 JP9.3 29.92,30.25 v30.75,30.25 | v6.62,35.75 v11.12,35.75
  Bottom 0.254: v20.5,30.5 19.62,30.5 18.38,31.75 18.38,33.86 JP1.4 15.96,34.13 12.88,34.13 11.25,35.75 v11.12,35.75 | IC4.15 33,30.38 32.88,30.25 v30.75,30.25 | IC7.1 6.34,36.03 v6.62,35.75
N$1  (via drill 0.3)
  Top 0.254: IC1.12 17.62,18.35 17.45,18.2 17.45,17.66 v17.51,17.59
  Bottom 0.254: v17.51,17.59 17.7,17.61 R48.1
N$2  (via drill 0.3)
  Top 0.254: IC1.16 20.51,16.54 v20.38,16.4
  Bottom 0.254: v20.38,16.4 20.48,16.4 20.68,16.6 28.48,16.6 28.64,16.26 C24.1 28.86,16.25 C1.1
N$3
  Top 0.254: IC1.6 16.03,21.35 R10.2
N$4  (via drill 0.3)
  Top 0.254: IC1.8 17.38,20.35 17.38,19.5 16.62,18.89 16.27,18.89 v16.3,18.77 | 28.09,17.7 FB2.2 | C3.1 29.87,17.98 C2.1 FB2.2 | FB2.2 28.19,17.95 v26.8,17.95 26.4,18.35 IC1.25
  Bottom 0.254: v16.3,18.77 16.55,18.73 16.77,18.5 16.77,17.3 17.18,16.9 18.38,16.9 18.68,17.2 26.05,17.2 v26.8,17.95
N$5
  Top 0.254: IC1.2 16.75,23.35 16.75,23.48 R2.1 16.15,23.6 15.75,24 15.75,25.68 16.02,25.95 Y1.P$1 15.88,26.62 15.5,26.62 14.97,27.15 C16.1
N$6
  Top 0.254: IC1.1 17.52,23.85 17.38,24 17.38,24.88 | 17.38,24.88 16.62,24.88 | 16.62,24.88 16.52,24.88 | 17.38,24.88 18.5,26 18.5,27.12 18,27.62 17.77,27.62 Y1.P$3 17.68,28.82 C17.1 | R2.2 16.62,24.88
N$7
  Top 0.254: 27.89,19.85 R1.2 27.91,19.5 27.25,19.5 26.4,20.35 IC1.29
N$8
  Top 0.254: IC1.30 27.84,20.85 R5.2
N$9  (via drill 0.3)
  Top 0.254: v23.68,14.6 23.71,14.56 C21.1 24.87,13.81 25.07,13.6 27.68,13.6 28.27,14.2 28.27,16.27 FB2.1 | IC1.14 19.51,17.04 19.05,16.57 v19.05,15.8
  Bottom 0.254: v19.05,15.8 19.05,14.95 19.88,14.12 23.2,14.12 v23.68,14.6
N$10
  Top 0.254: R6.2 27.12,21.95 26.53,21.35 IC1.31
N$11
  Bottom 0.254: 22.12,42.38 22,42.25 SEL_L3.2 22.57,42.25 22.86,42.55 22.86,43.5 22.23,44.13 21.99,44.13 U1.4
N$12
  Top 0.254: IC1.7 17.1,20.85 16.88,20.62 16.88,20 16.75,19.88 R11.2
N$13
  Top 0.254: R32.2 14.63,25.7 14.85,25.7 LED6.C
N$14
  Top 0.254: R47.2 45.48,36.61 LED7.A
N$15
  Bottom 0.254: C28.1 R14.2
N$16  (via drill 0.3)
  Top 0.254: v15,43.75 14.62,43.38 LED1.A 14.64,42.52 R35.2
  Bottom 0.254: SEL_L1.3 15.05,43.06 v15,43.75
N$17  (via drill 0.3)
  Top 0.61: AG8100.4 77.41,21.84 v77.38,21.88
  Bottom 0.61: v77.38,21.88 77.38,23.61 R26.2
N$18
  Bottom 0.254: Q2.1 32.95,39.48 R17.2
N$20
  Bottom 0.254: R20.2 16.88,2 17.5,1.38 18.35,1.38 C23.1
N$21
  Bottom 0.254: R14.1 17.05,3.85 R20.1 15.15,4.03 13.5,2.38 11.5,2.38 11,2.88 9.66,4.22 C22.2 8.26,5.35 8.26,5.88 8.26,9.21 7.62,9.84 5.12,9.84 3.15,11.81 3,11.96 R36.1 R37.1
N$22
  Bottom 0.254: IC7.3 8.88,36.87 11,34.75 11.25,34.5 11.25,33.9 R18.1
N$23  (via drill 0.3)
  Top 0.254: v60.12,32.62 60.12,36.44 AG8100.10
  Bottom 0.254: R25.2 60.13,30.74 v60.12,32.62
N$24
  Bottom 0.406: FB4.1 55.28,11.72 56.62,10.38 56.62,8.93 IC2.3
N$25
  Top 0.254: U2.11 12.35,10.51 13.34,9.53 13.34,8.64 R30.1
N$26
  Bottom 1.016: D13.2 84.84,10.4 84.62,10.62 83.7,10.62 K2.13
N$27
  Top 0.254: U2.9 12.35,21.94 13.34,20.95 13.34,19.32 R31.1
N$28
  Bottom 0.254: R27.1 24.25,2.75 23.38,1.88 22.52,1.88 C15.2 22.48,1.88 21.75,1.88 21.25,2.38 R21.1
N$29
  Bottom 0.254: Y2.1 C18.1 46.88,19.63 46.88,21.88 46.5,22.25 45.88,22.25 45.5,22.62 R3.2 44.75,23.15 IC4.7
N$30
  Bottom 0.254: IC4.8 43.98,24.06 R3.1 43.52,22.18 Y2.3 44.4,21.1 44.62,20.88 44.62,18.45 C19.1
N$31
  Bottom 0.254: R29.1 21.32,6.03 C14.2 22.57,6.1 R28.1
N$32
  Bottom 0.254: C26.1 R36.2
N$33
  Bottom 0.61: CHARGE_SELECT.8 83.59,43.69 R40.2
N$34
  Bottom 0.61: CHARGE_SELECT.6 83.88,41.15 R41.2
N$35
  Bottom 0.61: CHARGE_SELECT.4 83.92,38.6 R42.2
N$36
  Bottom 0.61: CHARGE_SELECT.2 83.97,36.06 R43.2
N$37  (via drill 0.3)
  Top 0.254: v65.75,4.75 v59.75,4.75
  Bottom 0.254: R44.2 R45.2 58.85,4.75 v59.75,4.75 | U3.5 65.91,5.03 v65.75,4.75
N$38
  Bottom 0.254: C27.1 R37.2
N$39
  Bottom 0.254: SEL_L1.2 16.5,42.25 16.62,42.38 16.62,44.42 U1.8
N$40
  Top 0.254: C11.2 40.27,16.38 JP3.1
N$41
  Bottom 0.406: R46.2 67.38,2.48 U3.7 65.86,2.49 65.75,2.38 65.75,1.38 | 65.75,1.38 65.88,1.25 67.34,1.25 U3.8 | U3.1 65.59,1.22 65.75,1.38
N$42  (via drill 0.3)
  Top 0.254: v17.62,43.75 17.27,43.4 LED2.A 17.29,42.52 R34.2
  Bottom 0.254: v17.62,43.75 18,43.25 18.19,43.25 SEL_L2.3
N$43  (via drill 0.6)
  Top 0.61: L1.P$1 63.6,8.03 v64.25,7.62
  Bottom 0.61: v64.25,7.62 64.38,7.62 64.62,7.25 64.62,6.53 D6.1 64.6,3.23 63.88,2.5 62.14,2.5 U3.2
N$44
  Bottom 0.61: U3.3 60.02,3.76 C29.1
N$45  (via drill 0.3)
  Top 0.254: v20.12,43.75 19.92,43.55 LED3.A 19.93,42.52 R33.2
  Bottom 0.254: SEL_L3.3 20.81,43.06 v20.12,43.75
N$65  (via drill 0.3)
  Top 0.406: v44.88,6.88 42.19,6.88 JP3.4
  Bottom 0.406: D12.2 44.91,6.97 v44.88,6.88
N$68
  Top 0.254: LED5.C 56.25,14.5 57,13.75 58.76,13.75 K1.9
  Bottom 0.254: Q1.3 62.37,14.27 D3.2
  Bottom 0.61: K1.9 60.66,15.62 D3.2
N$69
  Bottom 0.254: Q1.1 63.1,17.84 R24.2
N$70
  Top 0.254: R23.1 54.72,15.38 LED5.A
N$71
  Top 0.254: LED4.A R22.1
N$74
  Bottom 0.254: SEL_L2.2 19.38,42.25 19.38,44.21 U1.6
N$100
  Bottom 0.254: SEL_L4.2 23.83,42.25 23.7,42.38 23.7,44.61 U1.2
P45  (via drill 0.6)
  Top 0.61: v34.38,3.63 34.38,2.13 D1.AC2
  Bottom 0.254: C26.2 3,17.71 3.25,17.96 3.88,17.96 4.12,17.71 4.12,16.34 4.88,15.59 5.53,15.59 U2.5
  Bottom 0.61: U2.5 6.27,15.6 U2.4 11.19,14.55 12.1,13.64 15.47,13.64 18.74,10.38 22.5,10.38 22.75,10.38 28.62,10.38 28.88,10.62 31,10.62 34.38,7.25 v34.38,3.63
P78  (via drill 0.6)
  Top 0.61: v36.88,3 36.88,2.11 D1.AC1
  Bottom 0.254: 6.07,17.59 6.12,17.64 | C27.2 1.88,18.21 2.38,18.71 4.47,18.71 U2.7
  Bottom 0.61: U2.7 6.12,17.64 6.33,17.64 U2.8 9.79,18.63 11.64,16.78 13.9,16.78 17.43,13.25 19.43,11.25 21.62,11.25 28.25,11.25 28.62,11.62 31.12,11.62 36.88,5.88 v36.88,3
PIEZO
  Bottom 0.254: R49.1 43.38,37.88 44.5,39 44.5,41.08 SG1.P$1 44.55,42.7 43.75,43.5 32.52,43.5 Q2.3 25.36,42.98 SEL_L4.3
POE_VDD
  Top 0.61: D2.+ 32.22,9.75 | 32.22,9.75 32.22,11.3 D5.C | AG8100.6 83.75,18.92 83.75,14.75 82.62,13.62 68.25,13.62 67.88,13.62 66.75,13.62 66.62,13.5 65.38,12.25 65.38,12 65.38,11.38 65.38,7.12 64.75,6.5 58.75,6.5 56.38,8.87 56.01,8.87 54.99,8.87 40.24,8.87 39.38,8 35.98,8 D1.+ 35.75,9.25 35.12,9.62 34.88,9.75 32.22,9.75
POE_VSS  (via drill 0.3, 0.6)
  Top 0.406: 29.48,12.38 D5.A
  Top 0.61: D2.- 29.48,9.15 v29.48,9.6 29.48,12.38 | AG8100.5 79.95,21.82 v80,21.88 84.38,21.88 85,21.25 85,14.5 85,14.38 83.12,12.5 82.62,12.5 67.5,12.5 66.38,11.38 66.38,7 65,5.62 58.38,5.62 56,8 55.38,8 53.38,8 40.62,8 38.75,6.12 v33.38,6.12 33.38,8.01 D1.-
  Bottom 0.61: v33.38,6.12 32.95,6.12 v29.48,9.6 18.35,9.6 | v80,21.88 80,23.69 R26.1
  other vias: 12.25,3.88 11.25,4.88
  pour Bottom: 0,23.03 0,0 19.88,0 19.88,8 10.46,22.71
  pour Top: 0,22.84 10.46,22.84 19.88,8 19.88,0 0,0
PWDN
  Top 0.254: IC1.45 20.51,26.01 20.51,26.75 R16.1
RCS
  Bottom 0.406: CHARGE_SELECT.7 88.64,43.98 87.75,44.88 87.62,45 79.17,45 AG102.3
  Bottom 0.61: CHARGE_SELECT.7 CHARGE_SELECT.5 CHARGE_SELECT.3 CHARGE_SELECT.1
RD+  (via drill 0.3)
  Top 0.254: IC1.20 22.51,16.84 22.07,16.4 22.07,7.15 v22.11,6.99 | v22.11,6.99 22.43,6.67 | 22.43,6.67 22.95,6.15 23.57,6.15 23.83,6.4 23.82,6.53 23.82,8.53 24.53,9.11 T1.6 | v22.11,6.99 22.43,6.67
  Top 0.61: 25.92,9.14 T1.6
  Bottom 0.254: R29.2 21.4,7.25 22.07,7.25 22.11,7.21 v22.11,6.99
RD-  (via drill 0.3)
  Top 0.254: IC1.21 23.01,16.71 22.57,16.27 22.57,8.62 22.57,8.05 v22.75,7.88 23.32,8.2 23.32,8.75 | 23.32,8.75 23.32,10.65 24.82,11.65 25.88,11.65 T1.8 | 23.32,8.62 23.32,8.75
  Bottom 0.254: R28.2 23.27,7.88 v22.75,7.88
RST  (via drill 0.3)
  Top 0.254: v50.62,17 50.62,18.5 50.62,18.75 50,19.58 47.38,19.58 45.25,17.38 43.12,17.38 43.02,17.38 C11.1 | S1.4 S1.3 11.23,33.34 R15.2 12.6,33.35 13.12,33.88 18.36,33.88 JP1.5 20.36,31.88 21.88,31.88 22.12,31.62 23.62,31.62 | 23.62,31.62 24.3,31.62 | 24.3,31.62 23.62,31.62 | 23.62,31.62 24.3,31.62 | 24.3,31.62 v24.5,31.7
  Bottom 0.254: v50.62,17 53.75,20 53.75,26.38 52.25,27.95 52.1,27.98 | IC4.29 52.1,27.98 | 52.1,27.98 53,28.88 53,32.25 47.25,38 44.88,38 40,33.12 30.62,33.12 29.5,33.12 28.62,34.12 27,36 25.38,36 25.25,35.88 25.25,33.5 24.62,32.88 24.62,31.95 v24.5,31.7
RX  (via drill 0.3)
  Top 0.254: JP3.3 39.2,9.33 40.62,10.75 42.62,10.75 43.25,11.38 43.25,11.75 47,15.5 v47.62,15.5
  Bottom 0.254: IC4.30 52.08,27.18 53.25,26 53.25,20.38 50.5,17.62 48.88,17.62 47.62,16.38 v47.62,15.5
RX1  (via drill 0.3)
  Top 0.254: v20.27,7.62 20.27,8
  Top 0.61: T1.10 19.1,10.38 20.27,9.2 20.27,8 v20.27,7.62 20.27,5.4 23.88,1.8 27.75,1.8 D2.AC2
  Bottom 0.254: v20.27,7.62 20.25,7.65 C28.2
RX+
  Top 0.61: T1.11 15.58,9.11 12.85,11.84 11,11.84 8.88,9.71 5.12,9.71 4,10.84 4,12.46 4.62,13.09 5.64,13.09 U2.3
RX-  (via drill 0.6)
  Top 0.61: v11.62,15.53 11.62,15.36 15.24,11.75 16.29,11.72 T1.9
  Bottom 0.61: v11.62,15.53 11.39,15.53 10.34,16.59 U2.6
SCK  (via drill 0.3)
  Top 0.254: IC1.42 22.01,25.64 22.62,26.25 22.62,29.62 v22.38,29.88 23.88,29.88 26.25,27.5 30.5,27.5 31.88,28.88 JP9.5 31.88,31.38 31.62,31.62 v30.62,31.62
  Bottom 0.254: v22.38,29.88 18.5,29.88 17,31.38 17,32.63 JP1.3 16.96,32.66 15.88,33.71 12.88,33.71 12.25,33.12 9.5,33.12 7.62,35 IC7.2 | IC4.17 43.04,32.67 42.25,31.88 41.5,31.88 41,31.38 35.5,31.38 30.88,31.38 v30.62,31.62
SCL  (via drill 0.3)
  Top 0.254: v46.88,28.75 45.88,28.75 44,30.62 42.05,32.58 42,32.58 41.67,32.58 41.38,32.88 41,33.2 32,33.2 29.34,35.91 JP9.4
  Bottom 0.254: IC4.28 46.9,28.77 v46.88,28.75
SDA  (via drill 0.3)
  Top 0.254: v46.12,29.62 45.75,29.62 44.38,31 42.38,33.14 42.36,33.12 41.75,33.12 41.12,33.65 34.25,33.65 31.88,36.12 JP9.6
  Bottom 0.254: IC4.27 46.17,29.57 v46.12,29.62
SLA+  (via drill 0.6)
  Top 0.61: v77.88,29.25 85.77,29.25 86.5,29.25 JP7.1
  Bottom 0.61: K2.11 76.06,12.69 74.38,14.38 74.38,25.75 77.12,28.5 | 77.12,28.5 v77.88,29.25 | AG102.10 31.2,46.55 31.32,46.3 33.38,44.25 61.38,44.25 77.12,28.5
SLA-  (via drill 0.6)
  Top 0.406: 86.89,31.88 86.89,31.89
  Top 0.61: 77.62,30.75 78.56,31.69 78.75,31.88 84.12,31.88 86.89,31.88 | 77.62,30.75 76.12,29.25 76.12,15.87 K2.6 | v76.88,31.5 77.62,30.75 | 86.89,31.89 JP7.2
  Bottom 0.61: AG102.9 AG102.8 36.28,46.72 37.38,45.62 62.75,45.62 v76.88,31.5
SPD_LED  (via drill 0.3)
  Top 0.254: IC1.4 15.88,22.35 15.07,23.15 v14.57,23.15 | U2.12 12.13,5 12.13,4.99 13.12,4 14.11,4 R8.2 | 10.25,14.01 10.25,13.46 | 10.25,13.46 10.25,14.01 | 10.25,14.01 10.25,21.5 10.25,23.25 v10.88,23.88 | 10.25,14.01 10.25,13.46 | 10.25,13.46 v11,12.71
  Bottom 0.254: v10.88,23.88 12.75,23.88 13.5,23.12 14.55,23.12 v14.57,23.15 | v11,12.71 11,8.87 U2.12
STRIKE  (via drill 0.3)
  Top 0.254: v42.12,21.62 42.12,21.5 42.38,21.5 45.12,21.5 46.75,20 50.38,20 51.38,18.88 v51.38,16.75
  Bottom 0.254: IC4.12 43.65,27.98 43.75,27.88 43.75,25.25 43.12,24.62 43.12,23.75 42.25,22.88 42.25,21.75 v42.12,21.62 | v51.38,16.75 52.38,17.75 52.88,18.26 53.98,18.26 | R24.1 53.98,18.26 | TP2.P$1 54.29,17.94 53.98,18.26
STRIKE_NC  (via drill 0.6)
  Top 0.61: JP4.3 80.31,1.31 80,1 71.88,1 71.12,1.62 v71.12,3.62
  Bottom 0.61: K1.1 58.12,9.25 59.75,7.62 62.12,7.62 63.25,8.62 65.25,8.62 66.38,7.62 67.75,7.62 | v71.12,3.62 71.12,4.25 67.94,7.44 | 67.94,7.44 67.75,7.62 | 67.75,7.62 67.94,7.44
STRIKE_NO
  Bottom 0.61: K1.10 58.12,14.26 59.38,13 59.38,9.25 60,8.62 61.75,8.62 62.75,9.5 65.75,9.5 66.88,8.5 68.12,8.5 72.5,4.12 73.62,4.12 JP4.1
TD+  (via drill 0.3)
  Top 0.254: IC1.17 21.01,5.96 21.36,5.61 | T1.1 24.93,2.75 24.83,2.65 24.32,2.65 21.36,5.61 | v21.62,5.25 21.61,5.39 21.36,5.61
  Bottom 0.254: R21.2 21.25,4.9 v21.62,5.25
TD-  (via drill 0.3)
  Top 0.254: IC1.18 21.51,6.21 21.54,6.21 22.75,5 23.68,5 v23.82,5.15 24.07,5.4 25.78,5.4 T1.3 25.88,5.3
  Bottom 0.254: R27.2 24.57,5.08 v23.82,5.15
TX  (via drill 0.3)
  Top 0.254: JP3.2 42.49,11.87 v47,16.38
  Bottom 0.254: IC4.31 52,26.38 52.75,25.62 52.75,20.5 50.25,18.12 48.75,18.12 v47,16.38
TX1  (via drill 0.3)
  Top 0.254: v19.61,3.61 19.8,3.42
  Top 0.406: 17.66,4 T1.15
  Top 0.61: 17.66,4 19.23,4 v19.61,3.61 19.8,3.42 22.43,0.8 29.93,0.8 30.05,0.81 30.55,1.2 D2.AC1
  Bottom 0.254: v19.61,3.61 19.52,3.52 19.5,3.25 19,2.75 18.88,2.62 18.4,2.62 C23.2
TX+  (via drill 0.6)
  Top 0.254: 17.53,2.65 T1.16
  Top 0.61: v9.25,6.38 9.25,5.25 11.75,2.75 17.63,2.75 T1.16
  Bottom 0.61: U2.1 5.57,11.52 6.38,10.71 8.5,10.71 9.25,9.96 v9.25,6.38
TX-  (via drill 0.6)
  Top 0.61: T1.14 15.92,5.29 v15.38,5.25
  Bottom 0.61: v15.38,5.25 15.38,5.12 13.25,3 11.88,3 10.38,4.5 10.38,8.3 10.38,10.2 8.06,12.51 U2.2
V_GND  (via drill 0.3)
  Top 0.254: LED7.C 46.89,33.74 47.38,33.25 48.75,33.25 C43.-
  Bottom 0.61: K2.1 88.77,19.14 89.12,19.5 89.12,23.75 89.12,25.62 | 73.38,24.38 73.38,16.5 72.56,15.69 K2.8 70.98,13.41 D4.2 | JP10.2 87.75,25.12
  other vias: 55.75,37 58.38,37 52.88,39.88 53.88,43 54.62,41.12 58.62,42.12 57.12,43.12 59.75,40.88 57.12,41 58.5,39.88 55.88,42.25 55.88,39.75 52.5,41.88 51.25,43 51.25,40.75 50.88,39 60.62,42.38 75.88,38.12 78.62,37.25 81.38,37.12 79.5,40.38 78,40.62 75.88,39.88 76.62,41.62 78.12,42.75 79,43.88 79.12,41.75 75.12,42.62 76.62,43.62 74.88,41.12 73.12,42.5 73.12,41.12 73.25,39.5 74.38,38.25 71.25,41
  pour Top: 89.88,50 89.88,24 84,24 84,33.88 54.62,33.88 54.62,31.38 48,31.38 48,50
  pour Bottom: 50,50 89.88,50 89.88,24 50,24
V_POE  (via drill 0.3)
  Top 0.254: R22.2 52.15,29.52 | 52.15,29.52 52.12,30.12 | 52.15,29.52 52.5,29.88 v54,29.88
  Top 0.61: AG102.2 80.96,47.09 | AG102.2 AG102.1 | AG102.2 79.33,46.84 77.62,45.12 73.38,45.12 66.75,38.5 66.75,20.88
  Bottom 0.254: R25.1 54.62,29.09 v54,29.88
  Bottom 0.61: 71,8.08 K2.9
  other vias: 73.12,14.62 73.12,10.25 55.88,19.25 58.38,19.25 60.88,19.25 55.75,21.75 58.38,21.75 60.88,21.75 61.88,20.5 65.25,18.38 65.25,20.25 66.5,21.38 67.12,19.5 68.25,21 68.88,19.38 70,21 70.75,19.62 71.5,21 69.75,18 67.25,17.88 71.62,18 64.12,21.5 63.38,20.25 62.75,21.38
  pour Top: 48,30.1 54.62,30.1 54.62,22 90,22 90,8 61.5,8 61.5,15 48.12,15
  pour Bottom: 48,22 90,22 90,8 61.62,8 61.5,15 48,15

## Text on the board
tNames: BC | PWR | GND | NO | NC
bNames: TP1 | TP2 | NO | GND | NC
tDocu: 12V STRIKE OUT>
bDocu: PIEZO | GND | SLA 12V | V+ | HSBNE.org | SLA | Thermal | Open Hardware | Designed by | SNARC+ V3.0 | OSHW | Luke Hovington
_tsilk: 5V | E-SW/ | PIEZO | D3/I1 | Reset | FDX